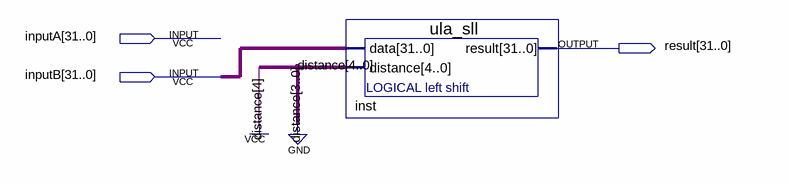
[diagram p0: schematic sheet]
// Quartus schematic lui.bdf as structural Verilog: 1 symbols, 3 pins
module lui (
  input  [31:0] inputA,
  input  [31:0] inputB,
  output [31:0] result
);

  ula_sll inst (.data(inputB), .distance(5'b10000), .result(result));
endmodule
